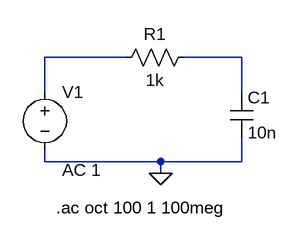
[diagram p0: schematic Low-pass filter, 1k, 10n, AFR.asc]
Low-pass filter, 1k, 10n, AFR.asc, the LTspice schematic file:
Version 4
SHEET 1 880 680
WIRE 208 64 96 64
WIRE 368 64 288 64
WIRE 96 112 96 64
WIRE 368 112 368 64
WIRE 96 208 96 192
WIRE 256 208 96 208
WIRE 368 208 368 176
WIRE 368 208 256 208
WIRE 256 224 256 208
FLAG 256 224 0
SYMBOL voltage 96 96 R0
WINDOW 123 24 124 Left 2
WINDOW 39 0 0 Left 2
SYMATTR Value2 AC 1
SYMATTR InstName V1
SYMATTR Value ""
SYMBOL res 304 48 R90
WINDOW 0 0 56 VBottom 2
WINDOW 3 32 56 VTop 2
SYMATTR InstName R1
SYMATTR Value 1k
SYMBOL cap 352 112 R0
SYMATTR InstName C1
SYMATTR Value 10n
TEXT 112 272 Left 2 !.ac oct 100 1 100meg

The netlist it stands for:
* Low-pass filter, 1k, 10n, AFR.asc
V1 N001 0 AC 1
R1 N002 N001 1k
C1 N002 0 10n
.ac oct 100 1 100meg
.backanno
.end